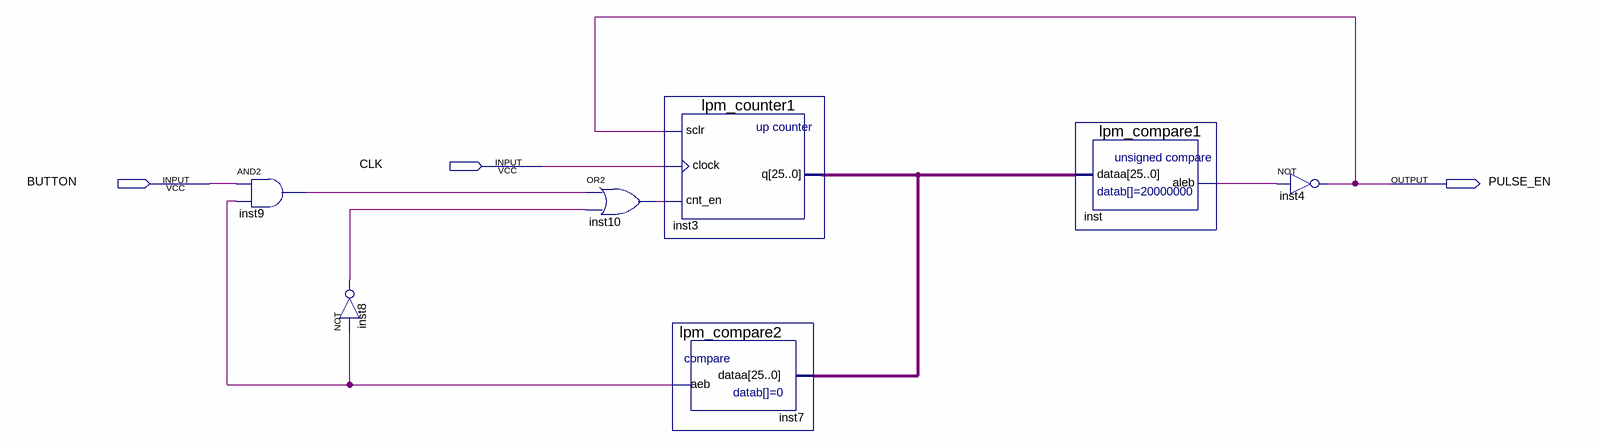
[diagram p0: schematic sheet]
// Quartus schematic g08_pulseGenerator.bdf as structural Verilog: 7 symbols, 3 pins
module g08_pulseGenerator (
  input  CLK,
  input  BUTTON,
  output PULSE_EN
);

  wire inst7_aeb, inst8_out, inst9_out, inst10_out, inst_aleb;
  wire [25:0] inst3_q;

  and inst9 (inst9_out, BUTTON, inst7_aeb);
  not inst8 (inst8_out, inst7_aeb);
  or inst10 (inst10_out, inst9_out, inst8_out);
  lpm_counter1 inst3 (.sclr(PULSE_EN), .clock(CLK), .cnt_en(inst10_out), .q(inst3_q));
  lpm_compare2 inst7 (.dataa(inst3_q), .aeb(inst7_aeb));
  lpm_compare1 inst (.dataa(inst3_q), .aleb(inst_aleb));
  not inst4 (PULSE_EN, inst_aleb);
endmodule
